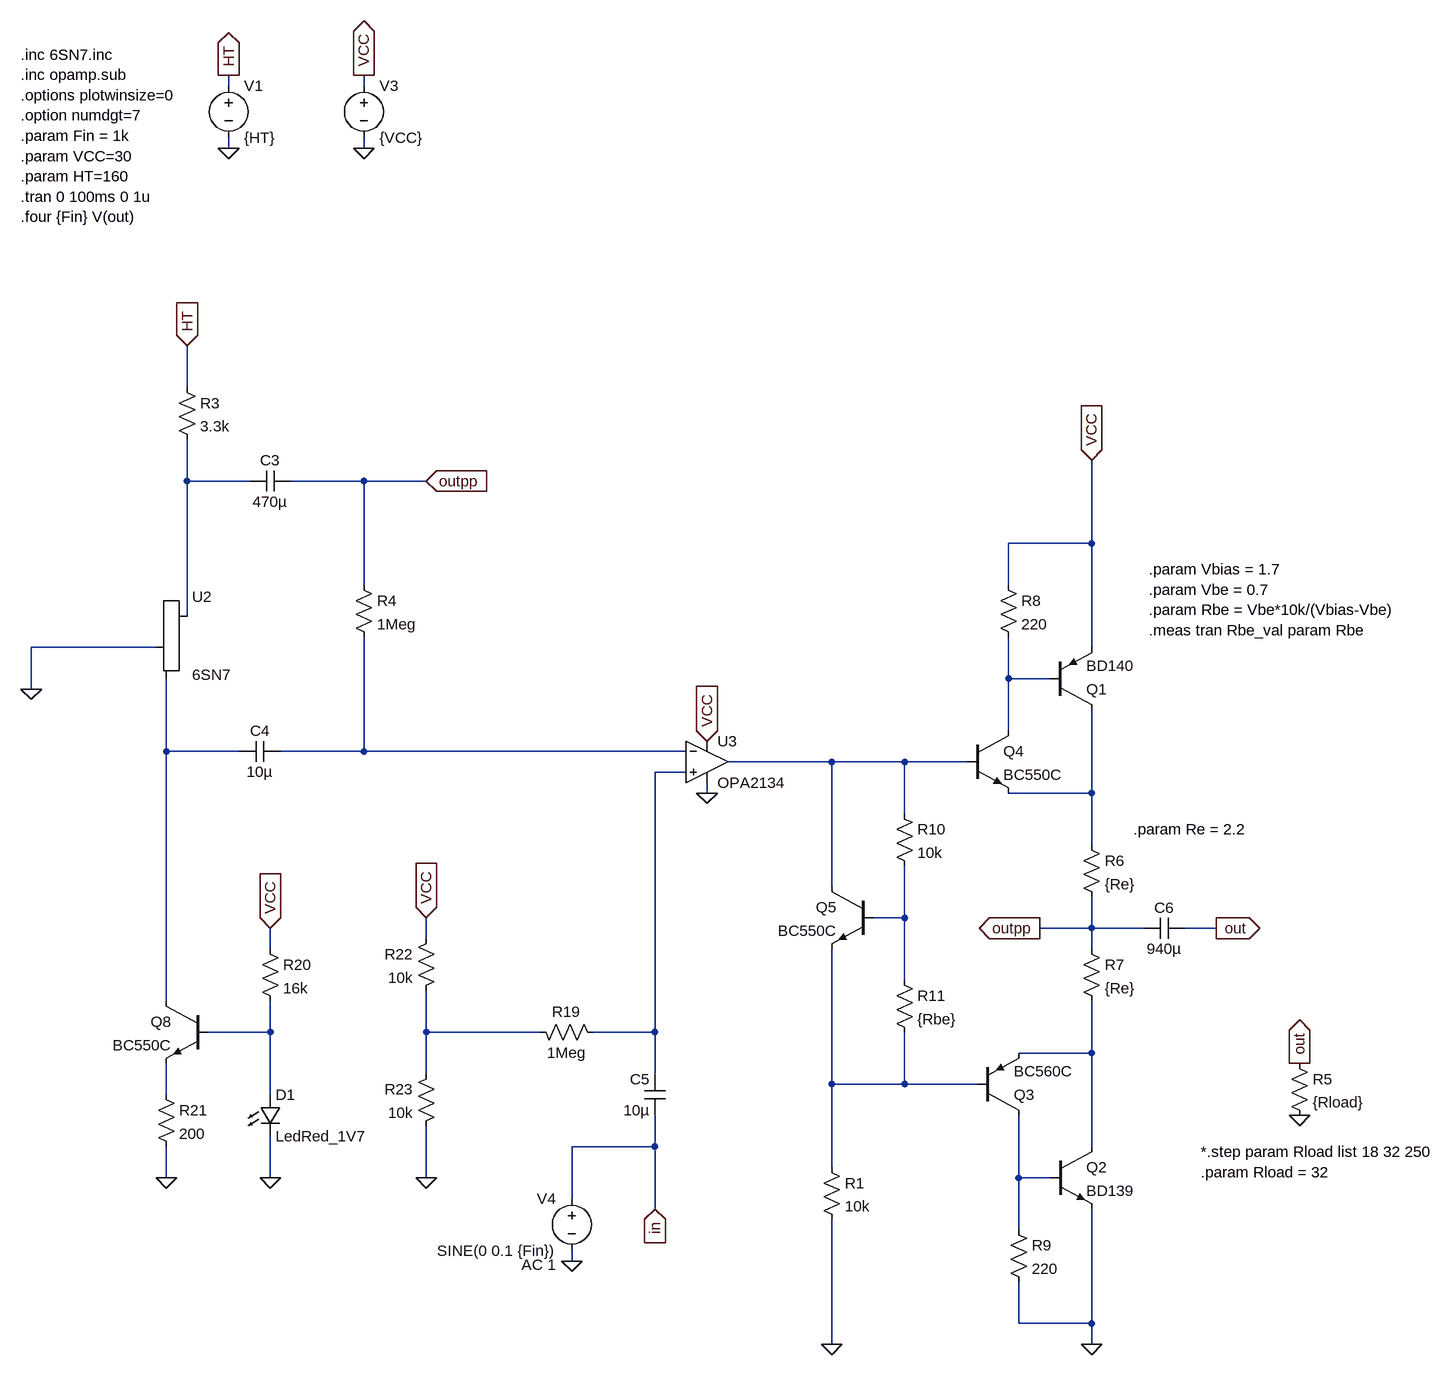
[diagram p0: schematic Super triode Opamp.asc]
Super triode Opamp.asc, the LTspice schematic file:
Version 4
SHEET 1 3464 1376
WIRE 1104 -576 1104 -592
WIRE 1312 -576 1312 -592
WIRE 1104 -480 1104 -496
WIRE 1312 -480 1312 -496
WIRE 1040 -112 1040 -176
WIRE 1040 32 1040 -32
WIRE 1136 32 1040 32
WIRE 1312 32 1200 32
WIRE 1408 32 1312 32
WIRE 2432 128 2432 0
WIRE 2432 128 2304 128
WIRE 1312 192 1312 32
WIRE 2304 192 2304 128
WIRE 1040 240 1040 32
WIRE 992 288 800 288
WIRE 2432 288 2432 128
WIRE 2304 336 2304 272
WIRE 2368 336 2304 336
WIRE 800 352 800 288
WIRE 2304 416 2304 336
WIRE 1008 448 1008 336
WIRE 1120 448 1008 448
WIRE 1312 448 1312 272
WIRE 1312 448 1184 448
WIRE 1808 448 1312 448
WIRE 2032 464 1872 464
WIRE 2144 464 2032 464
WIRE 2240 464 2144 464
WIRE 1808 480 1760 480
WIRE 1840 512 1840 496
WIRE 2432 512 2432 384
WIRE 2432 512 2304 512
WIRE 2144 544 2144 464
WIRE 2432 592 2432 512
WIRE 2032 656 2032 464
WIRE 2144 704 2144 624
WIRE 2144 704 2096 704
WIRE 2432 720 2432 672
WIRE 2432 720 2352 720
WIRE 2512 720 2432 720
WIRE 2624 720 2576 720
WIRE 1408 736 1408 704
WIRE 1168 752 1168 720
WIRE 2432 752 2432 720
WIRE 2144 800 2144 704
WIRE 1008 832 1008 448
WIRE 1168 880 1168 832
WIRE 1168 880 1072 880
WIRE 1408 880 1408 816
WIRE 1584 880 1408 880
WIRE 1760 880 1760 480
WIRE 1760 880 1664 880
WIRE 2432 912 2432 832
WIRE 2432 912 2320 912
WIRE 1408 944 1408 880
WIRE 1760 944 1760 880
WIRE 2032 960 2032 752
WIRE 2144 960 2144 880
WIRE 2144 960 2032 960
WIRE 2256 960 2144 960
WIRE 1008 976 1008 928
WIRE 1168 976 1168 880
WIRE 1760 1056 1760 1008
WIRE 1760 1056 1632 1056
WIRE 2432 1056 2432 912
WIRE 2032 1088 2032 960
WIRE 1008 1104 1008 1056
WIRE 1168 1104 1168 1040
WIRE 1408 1104 1408 1024
WIRE 2320 1104 2320 1008
WIRE 2368 1104 2320 1104
WIRE 1632 1136 1632 1056
WIRE 1760 1152 1760 1056
WIRE 2320 1184 2320 1104
WIRE 1632 1232 1632 1216
WIRE 2320 1328 2320 1264
WIRE 2432 1328 2432 1152
WIRE 2432 1328 2320 1328
WIRE 2032 1360 2032 1168
WIRE 2432 1360 2432 1328
FLAG 1104 -480 0
FLAG 1104 -592 HT
IOPIN 1104 -592 Out
FLAG 1312 -480 0
FLAG 1312 -592 VCC
IOPIN 1312 -592 Out
FLAG 1840 512 0
FLAG 1840 432 VCC
IOPIN 1840 432 In
FLAG 1040 -176 HT
IOPIN 1040 -176 In
FLAG 1408 32 outpp
IOPIN 1408 32 In
FLAG 800 352 0
FLAG 1632 1232 0
FLAG 2432 0 VCC
IOPIN 2432 0 In
FLAG 2624 720 out
IOPIN 2624 720 Out
FLAG 2752 928 out
IOPIN 2752 928 Out
FLAG 2752 1008 0
FLAG 2432 1360 0
FLAG 2352 720 outpp
IOPIN 2352 720 Out
FLAG 1760 1152 in
IOPIN 1760 1152 In
FLAG 1408 704 VCC
IOPIN 1408 704 In
FLAG 1168 720 VCC
IOPIN 1168 720 In
FLAG 1168 1104 0
FLAG 1008 1104 0
FLAG 1408 1104 0
FLAG 2032 1360 0
SYMBOL voltage 1104 -592 R0
SYMATTR InstName V1
SYMATTR Value {HT}
SYMBOL voltage 1312 -592 R0
SYMATTR InstName V3
SYMATTR Value {VCC}
SYMBOL Opamps_Add/OPA2134 1840 400 R0
SYMATTR InstName U3
SYMBOL Misc/triode 1040 288 R0
SYMATTR InstName U2
SYMATTR Value 6SN7
SYMBOL res 1024 -128 R0
SYMATTR InstName R3
SYMATTR Value 3.3k
SYMBOL cap 1200 16 R90
WINDOW 0 0 32 VBottom 2
WINDOW 3 32 32 VTop 2
SYMATTR InstName C3
SYMATTR Value 470µ
SYMBOL cap 1184 432 R90
WINDOW 0 0 32 VBottom 2
WINDOW 3 32 32 VTop 2
SYMATTR InstName C4
SYMATTR Value 10µ
SYMBOL res 1296 176 R0
SYMATTR InstName R4
SYMATTR Value 1Meg
SYMBOL voltage 1632 1120 M0
WINDOW 123 24 118 Left 2
SYMATTR Value2 AC 1
SYMATTR InstName V4
SYMATTR Value SINE(0 0.1 {Fin})
SYMBOL cap 1776 944 M0
SYMATTR InstName C5
SYMATTR Value 10µ
SYMBOL res 2736 912 R0
SYMATTR InstName R5
SYMATTR Value {Rload}
SYMBOL res 2416 576 R0
SYMATTR InstName R6
SYMATTR Value {Re}
SYMBOL res 2416 736 R0
SYMATTR InstName R7
SYMATTR Value {Re}
SYMBOL pnp 2368 384 M180
SYMATTR InstName Q1
SYMATTR Value BD140
SYMBOL npn 2368 1056 R0
SYMATTR InstName Q2
SYMATTR Value BD139
SYMBOL cap 2576 704 R90
WINDOW 0 0 32 VBottom 2
WINDOW 3 32 32 VTop 2
SYMATTR InstName C6
SYMATTR Value 940µ
SYMBOL pnp 2256 1008 M180
SYMATTR InstName Q3
SYMATTR Value BC560C
SYMBOL npn 2240 416 R0
SYMATTR InstName Q4
SYMATTR Value BC550C
SYMBOL res 2288 176 R0
SYMATTR InstName R8
SYMATTR Value 220
SYMBOL res 2304 1168 R0
SYMATTR InstName R9
SYMATTR Value 220
SYMBOL npn 2096 656 M0
SYMATTR InstName Q5
SYMATTR Value BC550C
SYMBOL res 2128 528 R0
SYMATTR InstName R10
SYMATTR Value 10k
SYMBOL res 2128 784 R0
SYMATTR InstName R11
SYMATTR Value {Rbe}
SYMBOL res 1568 864 M90
WINDOW 0 0 56 VBottom 2
WINDOW 3 32 56 VTop 2
SYMATTR InstName R19
SYMATTR Value 1Meg
SYMBOL LED 1152 976 R0
SYMATTR InstName D1
SYMATTR Value LedRed_1V7
SYMBOL res 1152 736 R0
SYMATTR InstName R20
SYMATTR Value 16k
SYMBOL npn 1072 832 M0
SYMATTR InstName Q8
SYMATTR Value BC550C
SYMBOL res 992 960 R0
SYMATTR InstName R21
SYMATTR Value 200
SYMBOL res 1424 720 M0
SYMATTR InstName R22
SYMATTR Value 10k
SYMBOL res 1424 928 M0
SYMATTR InstName R23
SYMATTR Value 10k
SYMBOL res 2016 1072 R0
SYMATTR InstName R1
SYMATTR Value 10k
TEXT 784 -624 Left 2 !.inc 6SN7.inc\n.inc opamp.sub\n.options plotwinsize=0\n.option numdgt=7\n.param Fin = 1k\n.param VCC=30\n.param HT=160\n.tran 0 100ms 0 1u\n.four {Fin} V(out)
TEXT 2600 1064 Left 2 !*.step param Rload list 18 32 250\n.param Rload = 32
TEXT 2520 168 Left 2 !.param Vbias = 1.7\n.param Vbe = 0.7\n.param Rbe = Vbe*10k/(Vbias-Vbe)\n.meas tran Rbe_val param Rbe
TEXT 2496 568 Left 2 !.param Re = 2.2

The netlist it stands for:
* Super triode Opamp.asc
V1 HT 0 {HT}
V3 VCC 0 {VCC}
* U3: OPA2134 (symbol Opamps_Add/OPA2134 not available, pins judged from their places): In+=N006 In-=N004 V+=VCC V-=0 OUT=N005
XU2 N001 0 N003 6SN7
R3 HT N001 3.3k
C3 outpp N001 470µ
C4 N004 N003 10µ
R4 outpp N004 1Meg
V4 in 0 SINE(0 0.1 {Fin}) AC 1
C5 N006 in 10µ
R5 out 0 {Rload}
R6 N007 outpp {Re}
R7 outpp N011 {Re}
Q1 N007 N002 VCC 0 BD140
Q2 N011 N014 0 0 BD139
C6 out outpp 940µ
Q3 N014 N012 N011 0 BC560C
Q4 N002 N005 N007 0 BC550C
R8 VCC N002 220
R9 N014 0 220
Q5 N005 N008 N012 0 BC550C
R10 N005 N008 10k
R11 N008 N012 {Rbe}
R19 N010 N006 1Meg
D1 N009 0 LedRed_1V7
R20 VCC N009 16k
Q8 N003 N009 N013 0 BC550C
R21 N013 0 200
R22 VCC N010 10k
R23 N010 0 10k
R1 N012 0 10k
.model D D
.lib standard.dio
.model NPN NPN
.model PNP PNP
.lib standard.bjt
.inc 6SN7.inc
.inc opamp.sub
.options plotwinsize=0
.option numdgt=7
.param Fin = 1k
.param VCC=30
.param HT=160
.tran 0 100ms 0 1u
.four {Fin} V(out)
*.step param Rload list 18 32 250
.param Rload = 32
.param Vbias = 1.7
.param Vbe = 0.7
.param Rbe = Vbe*10k/(Vbias-Vbe)
.meas tran Rbe_val param Rbe
.param Re = 2.2
.backanno
.end